# EAGLE schematic NA-board (EAGLE 9.6.2)
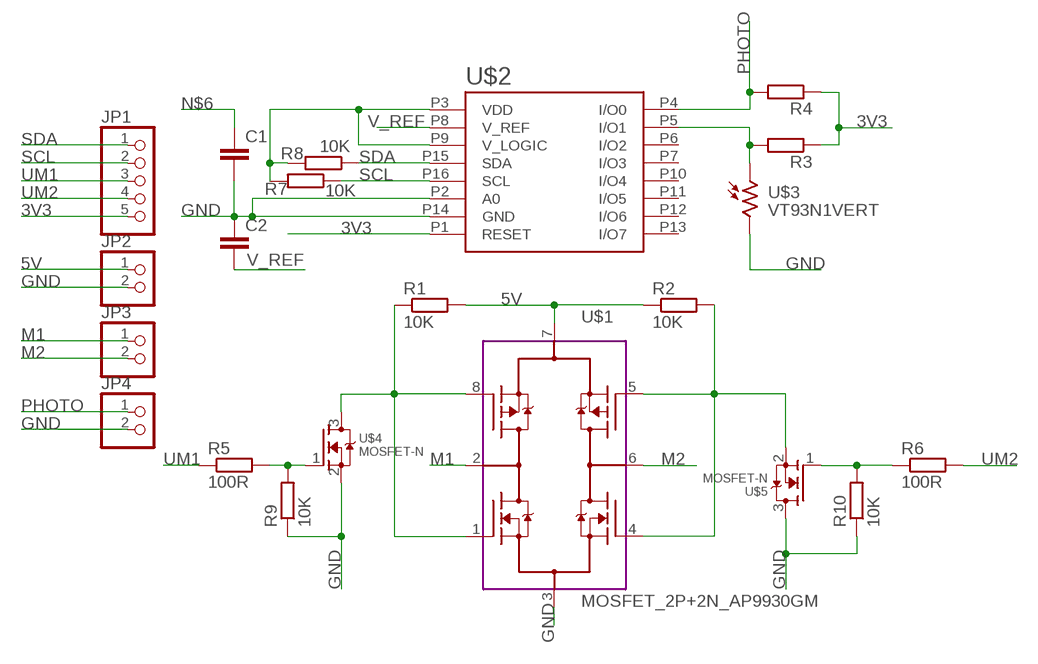
[diagram p0: schematic, sheet 1]

## Parts
C1  C-EUC0603  [C0603]
C2  C-EUC0603  [C0603]
JP1  PINHD-1X5  [1X05]
JP2  PINHD-1X2  [1X02]
JP3  PINHD-1X2  [1X02]
JP4  PINHD-1X2  [1X02]
R1  10K  R-EU_R0603  [R0603]
R2  10K  R-EU_R0603  [R0603]
R3  R-EU_R0603  [R0603]
R4  R-EU_R0603  [R0603]
R5  100R  R-EU_R0603  [R0603]
R6  100R  R-EU_R0603  [R0603]
R7  10K  R-EU_R0603  [R0603]
R8  10K  R-EU_R0603  [R0603]
R9  10K  R-EU_R0603  [R0603]
R10  10K  R-EU_R0603  [R0603]
U$1  MOSFET_2P+2N_AP9930GM  [SO8]
U$2  AD5593R  [AD5593R]
U$3  VT93N1VERT  [VT93N1-VERT]
U$4  MOSFET-N  [SOT23-3]
U$5  MOSFET-N  [SOT23-3]

## Nets
3V3: JP1.5 R3.1 R4.1 R7.2 R8.2 U$2.P1(RESET) U$2.P3(VDD) U$2.P9(V_LOGIC)
5V: JP2.1 R1.2 R2.1 U$1.7(P1P2S)
GND: C1.2 C2.1 JP2.2 JP4.2 R9.1 R10.1 U$1.3(N1N2S) U$2.P2(A0) U$2.P14(GND) U$3.P$2 U$4.2(S) U$5.3(D)
M1: JP3.1 U$1.2(P1N1D)
M2: JP3.2 U$1.6(P2N2D)
N$1: R5.2 R9.2 U$4.1(G)
N$2: R2.2 U$1.4(N2G) U$1.5(P2G) U$5.2(S)
N$3: R1.1 U$1.1(N1G) U$1.8(P1G) U$4.3(D)
N$4: R3.2 U$2.P5(I/O1) U$3.P$1
N$5: R6.1 R10.2 U$5.1(G)
N$6: C1.1
PHOTO: JP4.1 R4.2 U$2.P4(I/O0)
SCL: JP1.2 R7.1 U$2.P16(SCL)
SDA: JP1.1 R8.1 U$2.P15(SDA)
UM1: JP1.3 R5.1
UM2: JP1.4 R6.2
V_REF: C2.2 U$2.P8(V_REF)
Unconnected: U$2.P6(I/O2) U$2.P7(I/O3) U$2.P10(I/O4) U$2.P11(I/O5) U$2.P12(I/O6) U$2.P13(I/O7)

## Library data of the parts
C1 C2 = rcl:C-EU: CAPACITOR, European symbol; SPICEPREFIX: C
JP1 = pinhead:PINHD-1X5: PIN HEADER
JP2-JP4 = pinhead:PINHD-1X2: PIN HEADER
R1-R10 = rcl:R-EU_: RESISTOR, European symbol; SPICEPREFIX: R
U$1 = NA-2025:MOSFET_2P+2N_AP9930GM
U$2 = NA-2025:AD5593R
U$3 = KNPN-2023:VT93N1
U$4 U$5 = NA-2025:MOSFET-N